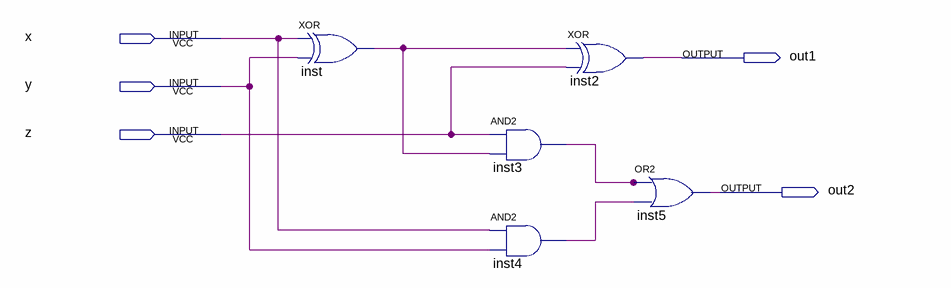
[diagram p0: schematic sheet]
// Quartus schematic combinationalcircuit.bdf as structural Verilog: 5 symbols, 5 pins
module combinationalcircuit (
  input  x,
  input  y,
  input  z,
  output out1,
  output out2
);

  wire inst3_out, inst4_out, inst_out;

  xor inst (inst_out, x, y);
  and inst3 (inst3_out, z, inst_out);
  and inst4 (inst4_out, x, y);
  xor inst2 (out1, inst_out, z);
  or inst5 (out2, inst3_out, inst4_out);
endmodule
